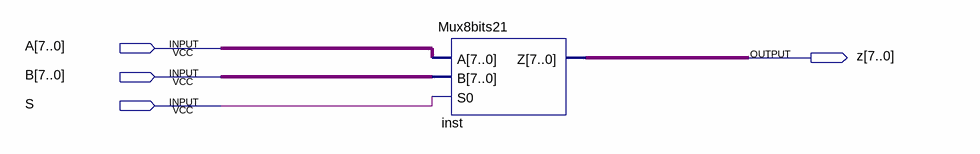
[diagram p0: schematic sheet]
// Quartus schematic Neander.bdf as structural Verilog: 1 symbols, 4 pins
module Neander (
  input  [7:0] A,
  input  [7:0] B,
  input  S,
  output [7:0] z
);

  Mux8bits21 inst (.A(A), .B(B), .S0(S), .Z(z));
endmodule
